# Altium schematic sheet P1.schdoc
size 178 x 97 mm; Symbol: Drawing-Symbol_A4; Company: 嘉立创EDA; Version: V1.0; Page Size: A4; @Project Name: PCB; @Update Date: 2026-07-19; @Create Date: 2026-07-19; Device: Drawing-Symbol_A4; @Board Name: Board1; @Page Name: P1; @Create Time: 23:37:44; @Page Count: 1; @Page No: 1; @Schematic Name: Schematic1; @Update Time: 23:37:44; @Assembly Variant: Basic; Border: 0; Title Block Position: 3; Size: A4; Width: 1170; Height: 825; Region Start: 1; X Region Count: 6; Y Region Count: 4; Blade Width: 10
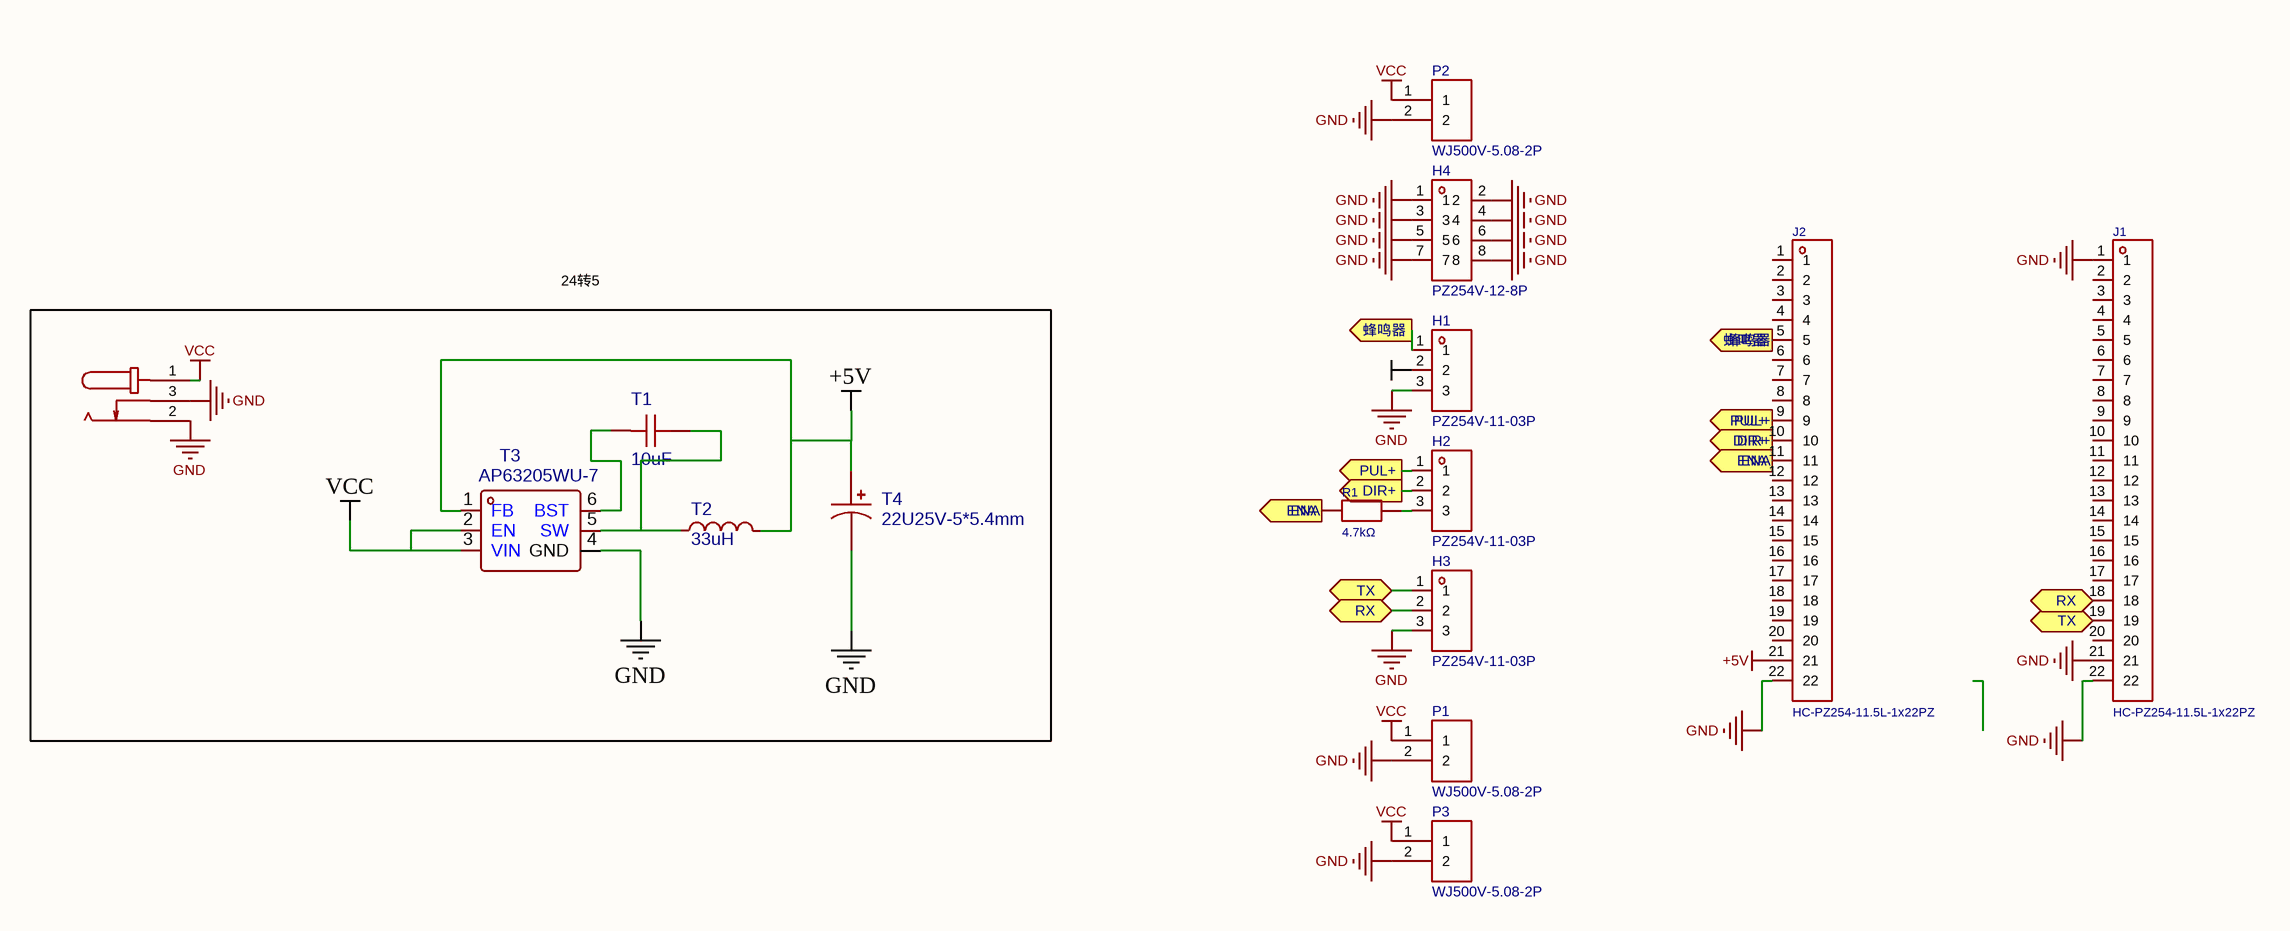
[diagram p0: P1.schdoc]

## Parts
DC1  DC005  [DC-IN-TH_DC005]  (value not drawn)
H1  PZ254V-11-03P  [HDR-TH_3P-P2.54-V-M_PZ254V-11-03P]
H2  PZ254V-11-03P  [HDR-TH_3P-P2.54-V-M_PZ254V-11-03P]
H3  PZ254V-11-03P  [HDR-TH_3P-P2.54-V-M_PZ254V-11-03P]
H4  PZ254V-12-8P  [HDR-TH_8P-P2.54-V-M-R2-C4-S2.54]
J1  HC-PZ254-11.5L-1x22PZ  [HDR-TH_22P-P2.54-V-M]
J2  HC-PZ254-11.5L-1x22PZ  [HDR-TH_22P-P2.54-V-M]
P1  WJ500V-5.08-2P  [CONN-TH_2P-P5.00_WJ500V-5.08-2P]
P2  WJ500V-5.08-2P  [CONN-TH_2P-P5.00_WJ500V-5.08-2P]
P3  WJ500V-5.08-2P  [CONN-TH_2P-P5.00_WJ500V-5.08-2P]
R1  4.7kΩ  [R0603]
T1  10uF  [C0603]
T2  33uH  [IND-SMD_L7.0-W6.6_FXL0650]
T3  AP63205WU-7  [TSOT-23-6_L2.9-W1.6-P0.95-LS2.8-BL]
T4  22U25V-5*5.4mm  [CAP-SMD_BD5.0-L5.3-W5.3-LS6.0-FD]

## Blocks framed on the sheet
24转5: DC1 T1-T4

## Ports
DIR+ (out), ENA (out), PUL+ (out), RX (bidir), TX (bidir), 蜂鸣器 (out)

## Nets
+5V: J2.21 T2.2 T3.1(FB) T4.1
GND: DC1.2 DC1.3 H1.3 H3.3 H4.1 H4.2 H4.3 H4.4 H4.5 H4.6 H4.7 H4.8 J1.1 J1.21 J1.22 J2.22 P1.2 P2.2 P3.2 T3.4(GND) T4.2
VCC: DC1.1 P1.1 P2.1 P3.1 T3.2(EN) T3.3(VIN)
DIR+: H2.2 J2.10 ; port DIR+
ENA: J2.11 R1.1 ; port ENA
PUL+: H2.1 J2.9 ; port PUL+
RX: H3.2 J1.18 ; port RX
TX: H3.1 J1.19 ; port TX
蜂鸣器: H1.1 J2.5 ; port 蜂鸣器
NetH2_3: H2.3 R1.2
NetT1_1: T1.1 T2.1 T3.5(SW)
NetT1_2: T1.2 T3.6(BST)

Not connected (* = marked no-connect by the designer): H1 2; J1 2 3 4 5 6 7 8 9 10 11 12 13 14 15 16 17 20; J2 1 2 3 4 6 7 8 12 13 14 15 16 17 18 19 20

## Notes on the sheet
- 原理图
- 板子
- Schematic1
- Board1
- 创建日期
- 更新日期
- 图页
- 2026-07-19
- P1
- 绘制
- 审阅
- PCB
- 版本
- 尺寸
- V1.0
- A4
- 嘉立创EDA

## Library data of the parts
DC1 = DC005: 连接器类型:DC电源插座;安装方式:弯插;触点内径:2mm;触点外径:6.3mm;额定电流:500mA;额定电压:12V;工作温度:-30℃~+70℃;; Manufacturer: SHOU HAN(首韩); Symbol: DC005_C431533; Add into BOM: yes; 3D Model Transform: 366.141,553.149,0,270,0,0,-141.734,88.583,-149.606; 3D Model: f168fe383f964e0ea2af0127ff6ac7b4; Connector Type: DC电源插座; Inside Contact Diameter: 2mm; Outside Contact Diameter: 6.3mm; Current Rating: 500mA; Voltage Rating (Max): 12V; Device: DC005; Convert to PCB: yes; Supplier: LCSC; Manufacturer Part: DC005; Supplier Part: C431533; LCSC Part Name: DC005-2.0 黑（铁）; Supplier Footprint: 插件; JLCPCB Part Class: Extended Part; Datasheet: https://item.szlcsc.com/datasheet/DC005/427890.html; Mounting Type: 弯插; Operating Temperature: -30℃~+70℃; FootprintName: DC-IN-TH_DC005; ModelName: DC-IN-TH_DC005
H1-H3 = PZ254V-11-03P: 插针结构:1x3P;间距:2.54mm;行距:-;圆针/方针:方针;安装方式:直插;排数:单排;总PIN位数:3P;额定电流:3A;额定电压:250V;配合针长度:6mm;塑高:2.5mm;端接针长度:3mm;工作温度:-40℃~+105℃;颜色:黑色;; Manufacturer: XFCN(兴飞); Symbol: PZ254V-11-03P_C2937625; AddInBom: yes; ModelId: bd28a638fbd247be9398fd5d39c366ec0819f05c4eef4c71ace90d822a990e87; ModelTransform: 300.3931,100,0,0,0,0,0,0,-118.11; Pin Structure: 1x3P; Pitch: 2.54mm; Circluar Pins/Square Pins: 方针; Current Rating: 3A; Voltage Rating (Max): 250V; Device: PZ254V-11-03P; LCSC Part Name: 1x3P 间距:2.54mm 方针 直插; SupplierPart: C2937625; ManufacturerPart: PZ254V-11-03P; Supplier Footprint: 插件,P=2.54mm; JLCPCB Part Class: Extended Part; Datasheet: https://item.szlcsc.com/datasheet/PZ254V-11-03P/3293280.html; Supplier: LCSC; ConvertToPcb: yes; FootprintName: HDR-TH_3P-P2.54-V-M_PZ254V-11-03P; ModelName: HDR-TH_3P-P2.54-V-M_PZ254V-11-03P; Row Spacing: -; Mounting Type: 直插; Number of Rows: 单排; Number of Pins: 3P; Length of Mating Pin: 6mm; Insulation Height: 2.5mm; Length of End Connection Pin: 3mm; Operating Temperature: -40℃~+105℃; Color: 黑色
H4 = PZ254V-12-8P: 插针结构:2x4P;间距:2.54mm;行距:2.54mm;圆针/方针:方针;安装方式:直插;排数:双排;总PIN位数:8P;额定电流:-;额定电压:-;配合针长度:6mm;塑高:2.5mm;端接针长度:3mm;触头材质:黄铜;触头镀层:-;工作温度:-40℃~+105℃;颜色:黑色;; Manufacturer: XFCN(兴飞); AddInBom: yes; ModelId: 9655140a9899454ea9d6a6732d55fb0e0819f05c4eef4c71ace90d822a990e87; ModelName: HDR-TH_8P-P2.54-M-LI-2X4P; ModelTransform: 399.999,200,0,0,0,0,0,0,-118.11; Pin Structure: 2x4P; Pitch: 2.54mm; Circluar Pins/Square Pins: 方针; Symbol: PZ254V-12-8P; Device: PZ254V-12-8P; LCSC Part Name: 2x4P 间距:2.54mm 方针 直插; SupplierPart: C492421; ManufacturerPart: PZ254V-12-8P; Supplier Footprint: 插件,P=2.54mm; JLCPCB Part Class: Extended Part; Datasheet: https://item.szlcsc.com/datasheet/PZ254V-12-8P/502977.html; Supplier: LCSC; ConvertToPcb: yes; FootprintName: HDR-TH_8P-P2.54-V-M-R2-C4-S2.54; Row Spacing: 2.54mm; Mounting Type: 直插; Number of Rows: 双排; Number of Pins: 8P; Current Rating: -; Voltage Rating (Max): -; Length of Mating Pin: 6mm; Insulation Height: 2.5mm; Length of End Connection Pin: 3mm; Contact Material: 黄铜; Contact Plating: -; Operating Temperature: -40℃~+105℃; Color: 黑色
J1 J2 = HC-PZ254-11.5L-1x22PZ: 插针结构:1x22P;间距:2.54mm;行距:-;圆针/方针:方针;安装方式:直插;排数:单排;总PIN位数:22P;额定电流:3A;额定电压:-;配合针长度:6mm;塑高:2.5mm;端接针长度:3mm;触头材质:黄铜;触头镀层:金;工作温度:-40℃~+105℃;颜色:黑色;; Manufacturer: HC(虹成电子); Add into BOM: yes; 3D Model: 875f4c094945453e8148e92095c9b8a7; 3D Model Transform: 2199.99552,98.425,0,0,0,0,0,0,-118.11; Pin Structure: 1x22P; Pitch: 2.54mm; Circluar Pins/Square Pins: 方针; Current Rating: 3A; ModelName: HDR-TH_22P-P2.54-M-LI-1X22P; Symbol: HC-PZ254-11.5L-1X22PZ; Device: HC-PZ254-11.5L-1x22PZ; Convert to PCB: yes; Manufacturer Part: HC-PZ254-11.5L-1x22PZ; Supplier: LCSC; Supplier Part: C41375941; LCSC Part Name: 1x22P 间距:2.54mm 方针 直插; Supplier Footprint: 插件,P=2.54mm; JLCPCB Part Class: Extended Part; Datasheet: https://item.szlcsc.com/datasheet/HC-PZ254-11.5L-1x22PZ/43143790.html; Row Spacing: -; Mounting Type: 直插; Number of Rows: 单排; Number of Pins: 22P; Voltage Rating (Max): -; Length of Mating Pin: 6mm; Insulation Height: 2.5mm; Length of End Connection Pin: 3mm; Contact Material: 黄铜; Contact Plating: 金; Operating Temperature: -40℃~+105℃; Color: 黑色; FootprintName: HDR-TH_22P-P2.54-V-M
P1 = WJ500V-5.08-2P: 结构:1x2P;间距:5.08mm;颜色:绿色;安装方式:直插;额定电流:18A;额定电压:250V;排数:1;线规 - AWG:14~30;线规 - 平方毫米:2.5;每排PIN数:2;触头材质:-;触头镀层:-;工作温度范围:-40℃~+105℃;焊接温度(最大值):-;; Manufacturer: KANGNEX(康奈克斯电气); Symbol: WJ500V-5.08-2P-14-00A; AddInBom: yes; ModelId: 0f4a503c8d3b4ae19ed61267f5e9a1d70819f05c4eef4c71ace90d822a990e87; ModelTransform: 423.621,393.7,0,0,0,0,-11.811,19.685,-137.795; Structure: 1x2P; Pitch: 5.08mm; Current Rating (Max): 18A; Voltage Rating (Max): 250V; Wire Gauge - AWG: 14~30; Wire Gauge - mm2: 2.5; Number of PINs Per Row: 2; Screw Specification: M2.5; Device: WJ500V-5.08-2P; LCSC Part Name: 1x2P 5.08mm 直插 排数:1 每排P数:2; SupplierPart: C8465; ManufacturerPart: WJ500V-5.08-2P; Supplier Footprint: 插件,P=5.08mm; JLCPCB Part Class: Extended Part; Datasheet: https://atta.szlcsc.com/upload/public/pdf/source/20191225/C8465_02D34CE5B5B4A53DF5891601D97FA9F4.pdf; Supplier: LCSC; ConvertToPcb: yes; FootprintName: CONN-TH_2P-P5.00_WJ500V-5.08-2P; ModelName: CONN-TH_2P-P5.00_WJ500V-5.08-2P; Color: 绿色; Mounting Style: 直插; Number of Pins: 2P; Number of Rows: 1; Contact Material: -; Contact Plating: -; Operating Temperature Range: -40℃~+105℃; Soldering Temperature(Max): -
P2 P3 = WJ500V-5.08-2P: 结构:1x2P;间距:5.08mm;颜色:绿色;安装方式:直插;额定电流:18A;额定电压:250V;排数:1;线规 - AWG:14~30;线规 - 平方毫米:2.5;每排PIN数:2;触头材质:-;触头镀层:-;工作温度范围:-40℃~+105℃;焊接温度(最大值):-;; Manufacturer: KANGNEX(康奈克斯电气); Symbol: WJ500V-5.08-2P-14-00A; 3D Model: 0f4a503c8d3b4ae19ed61267f5e9a1d70819f05c4eef4c71ace90d822a990e87; 3D Model Transform: 423.621,393.7,0,0,0,0,-11.811,19.685,-137.795; Structure: 1x2P; Pitch: 5.08mm; Current Rating (Max): 18A; Voltage Rating (Max): 250V; Wire Gauge - AWG: 14~30; Wire Gauge - mm2: 2.5; Number of PINs Per Row: 2; Screw Specification: M2.5; AddInBom: yes; Device: WJ500V-5.08-2P; LCSC Part Name: 1x2P 5.08mm 直插 排数:1 每排P数:2; Supplier Part: C8465; Manufacturer Part: WJ500V-5.08-2P; Supplier Footprint: 插件,P=5.08mm; JLCPCB Part Class: Extended Part; Datasheet: https://atta.szlcsc.com/upload/public/pdf/source/20191225/C8465_02D34CE5B5B4A53DF5891601D97FA9F4.pdf; Supplier: LCSC; Color: 绿色; Mounting Style: 直插; Number of Pins: 2P; Number of Rows: 1; Contact Material: -; Contact Plating: -; Operating Temperature Range: -40℃~+105℃; Soldering Temperature(Max): -; ConvertToPcb: yes; FootprintName: CONN-TH_2P-P5.00_WJ500V-5.08-2P; ModelName: CONN-TH_2P-P5.00_WJ500V-5.08-2P
R1 = FRR0603F4701TS: 电阻类型:厚膜电阻;阻值:4.7kΩ;精度:±1%;功率:100mW;工作电压:75V;温度系数:±100ppm/℃;; Manufacturer: FOJAN(富捷); AddInBom: yes; ModelId: fc143cca1e79419f9cd78b61e9279f080819f05c4eef4c71ace90d822a990e87; ModelTransform: 31.8897,63.7794,0,90,0,0,0,0,0; Tolerance: ±1%; Power(Watts): 100mW; Voltage-Supply(Max): 75V; Symbol: FRR0603F4701TS; Device: FRR0603F4701TS; LCSC Part Name: 厚膜电阻 4.7KΩ ±1% 100mW; SupplierPart: C51048199; ManufacturerPart: FRR0603F4701TS; Supplier Footprint: 0603; JLCPCB Part Class: Extended Part; Datasheet: https://item.szlcsc.com/datasheet/FRR0603F4701TS/53696833.html; Supplier: LCSC; ConvertToPcb: yes; FootprintName: R0603; ModelName: R0603; Type: 厚膜电阻; Value: 4.7kΩ; Temperature Coefficient: ±100ppm/℃; Operating Temperature: -55℃~+155℃
T1 = 0603X106M100CT: 容值:10uF;精度:±20%;额定电压:10V;温度系数:X5R;; Manufacturer: Walsin(华新科); Add into BOM: yes; 3D Model Transform: 62.992,31.496,0,0,0,0,0,0,0; 3D Model: ac125912035d415993ca9572d50418b1; Tolerance: ±20%; Voltage Rating: 10V; Temperature Coefficient: X5R; ModelName: C0603_L1.6-W0.8-H0.8; Symbol: 0603X106M100; Device: 0603X106M100CT; Convert to PCB: yes; Supplier: LCSC; Manufacturer Part: 0603X106M100CT; Supplier Part: C89283; JLCPCB Part Class: Extended Part; LCSC Part Name: 10uF ±20% 10V; Supplier Footprint: 0603; Datasheet: https://item.szlcsc.com/datasheet/0603X106M100CT/90463.html; Value: 10uF; FootprintName: C0603
T2 = FXL0650-330-M: 电感值:33uH;精度:±20%;额定电流:2.3A;饱和电流(Isat):3A;类型:一体成型电感;; Manufacturer: cjiang(长江微电); Add into BOM: yes; 3D Model Transform: 275.59,259.842,0,0,0,0,0,0,0; 3D Model: 79e71cf45778409db1a3f3d6d59bfe87; Tolerance: ±20%; Current Rating: 2.3A; Current - Saturation(Isat): 3A; DC Resistance(DCR): 190mΩ; Type: 一体成型电感; ModelName: IND-SMD_L7.0-W6.6-H4.8_FXL0650; Symbol: FXL0650-330-M; Device: FXL0650-330-M; Convert to PCB: yes; Supplier: LCSC; Supplier Part: C475526; Manufacturer Part: FXL0650-330-M; LCSC Part Name: 33uH ±20% 3A; Supplier Footprint: SMD,7x6.6mm; JLCPCB Part Class: Extended Part; Datasheet: https://item.szlcsc.com/datasheet/FXL0650-330-M/482432.html; Value: 33uH; FootprintName: IND-SMD_L7.0-W6.6_FXL0650
T3 = AP63205WU-7: Manufacturer: DIODES(美台); Add into BOM: yes; Origin 3D Model Title: TSOT-23-6_L2.9-W1.6-H1.1-LS2.8-P0.95; 3D Model Transform: 110.236,114.173,0,90,0,0,0.001,-0.001,0; Symbol: AP63205WU-7; Device: AP63205WU-7; Convert to PCB: yes; Supplier: LCSC; Supplier Part: C2071056; Manufacturer Part: AP63205WU-7; JLCPCB Part Class: Extended Part; FootprintName: TSOT-23-6_L2.9-W1.6-P0.95-LS2.8-BL
T4 = 22U25V-5*5.4mm: Add into BOM: yes; 3D Model Transform: 236.22,208.661,0,0,0,0,-0.001,-0.003,0; 3D Model: ed942b427de741e3aabba01c64b2d723; Symbol: 22U25V-5*5.4MM; Device: 22U25V-5*5.4mm; Convert to PCB: yes; Supplier: LCSC; Supplier Part: C9900005778; Manufacturer Part: 22U25V-5*5.4mm; JLCPCB Part Class: Extended Part; LCSC Part Name: 22U25V-5*5.4mm; Supplier Footprint: CAP-SMD; FootprintName: CAP-SMD_BD5.0-L5.3-W5.3-LS6.0-FD; ModelName: CAP-SMD_BD5.0-L5.3-W5.3-LS6.0-FD